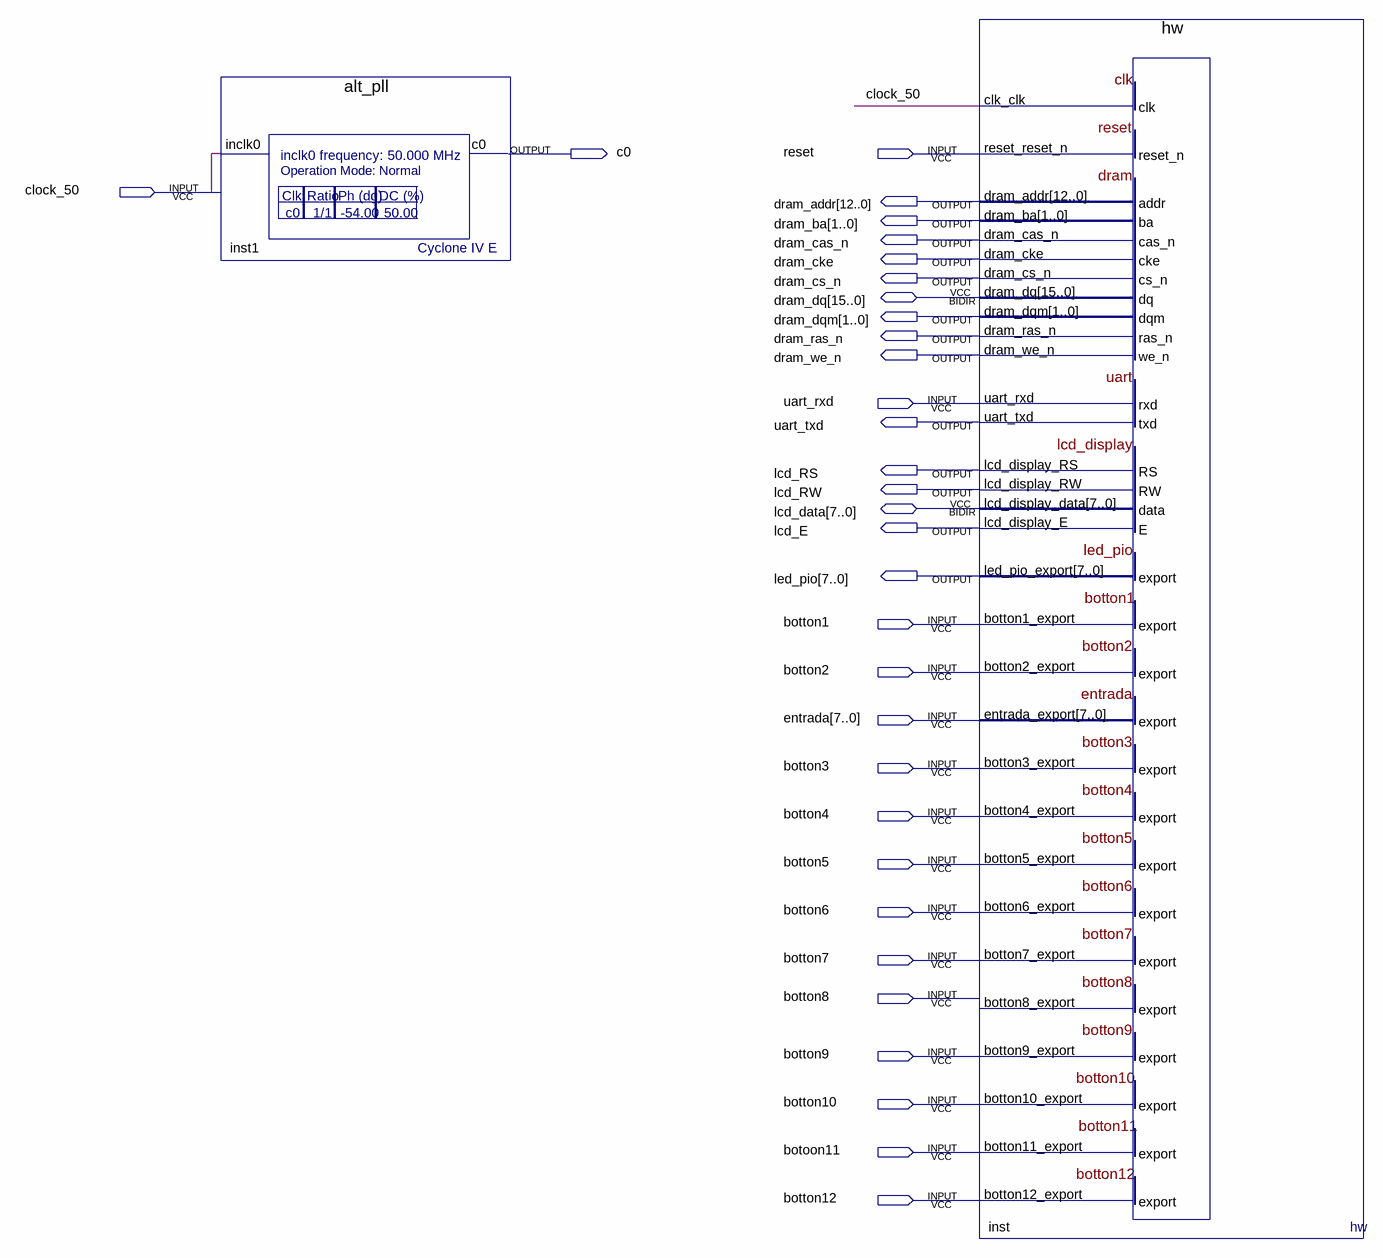
[diagram p0: schematic sheet]
// Quartus schematic block_sdram.bdf as structural Verilog: 2 symbols, 32 pins
module block_sdram (
  input  reset,
  input  clock_50,
  input  uart_rxd,
  input  botton1,
  input  botton2,
  input  [7:0] entrada,
  input  botton3,
  input  botton4,
  input  botton5,
  input  botton6,
  input  botton7,
  input  botton8,
  input  botton9,
  input  botton10,
  input  botoon11,
  input  botton12,
  inout  [15:0] dram_dq,
  inout  [7:0] lcd_data,
  output c0,
  output [12:0] dram_addr,
  output [1:0] dram_ba,
  output dram_cas_n,
  output dram_cke,
  output dram_cs_n,
  output [1:0] dram_dqm,
  output dram_ras_n,
  output dram_we_n,
  output uart_txd,
  output lcd_RS,
  output lcd_RW,
  output lcd_E,
  output [7:0] led_pio
);

  alt_pll inst1 (.inclk0(clock_50), .c0(c0));
  hw inst (
    .clk_clk(clock_50), .reset_reset_n(reset), .uart_rxd(uart_rxd), .botton1_export(botton1),
    .botton2_export(botton2), .entrada_export(entrada), .botton3_export(botton3), .botton4_export(botton4),
    .botton5_export(botton5), .botton6_export(botton6), .botton7_export(botton7), .botton9_export(botton9),
    .botton10_export(botton10), .botton11_export(botoon11), .botton12_export(botton12),
    .dram_addr(dram_addr), .dram_ba(dram_ba), .dram_cas_n(dram_cas_n), .dram_cke(dram_cke),
    .dram_cs_n(dram_cs_n), .dram_dqm(dram_dqm), .dram_ras_n(dram_ras_n), .dram_we_n(dram_we_n),
    .uart_txd(uart_txd), .lcd_display_RS(lcd_RS), .lcd_display_RW(lcd_RW), .lcd_display_E(lcd_E),
    .led_pio_export(led_pio), .dram_dq(dram_dq), .lcd_display_data(lcd_data));  // open: botton8_export
endmodule
